# Altium schematic sheet Schematic_PixelRing.SchDoc
size A4
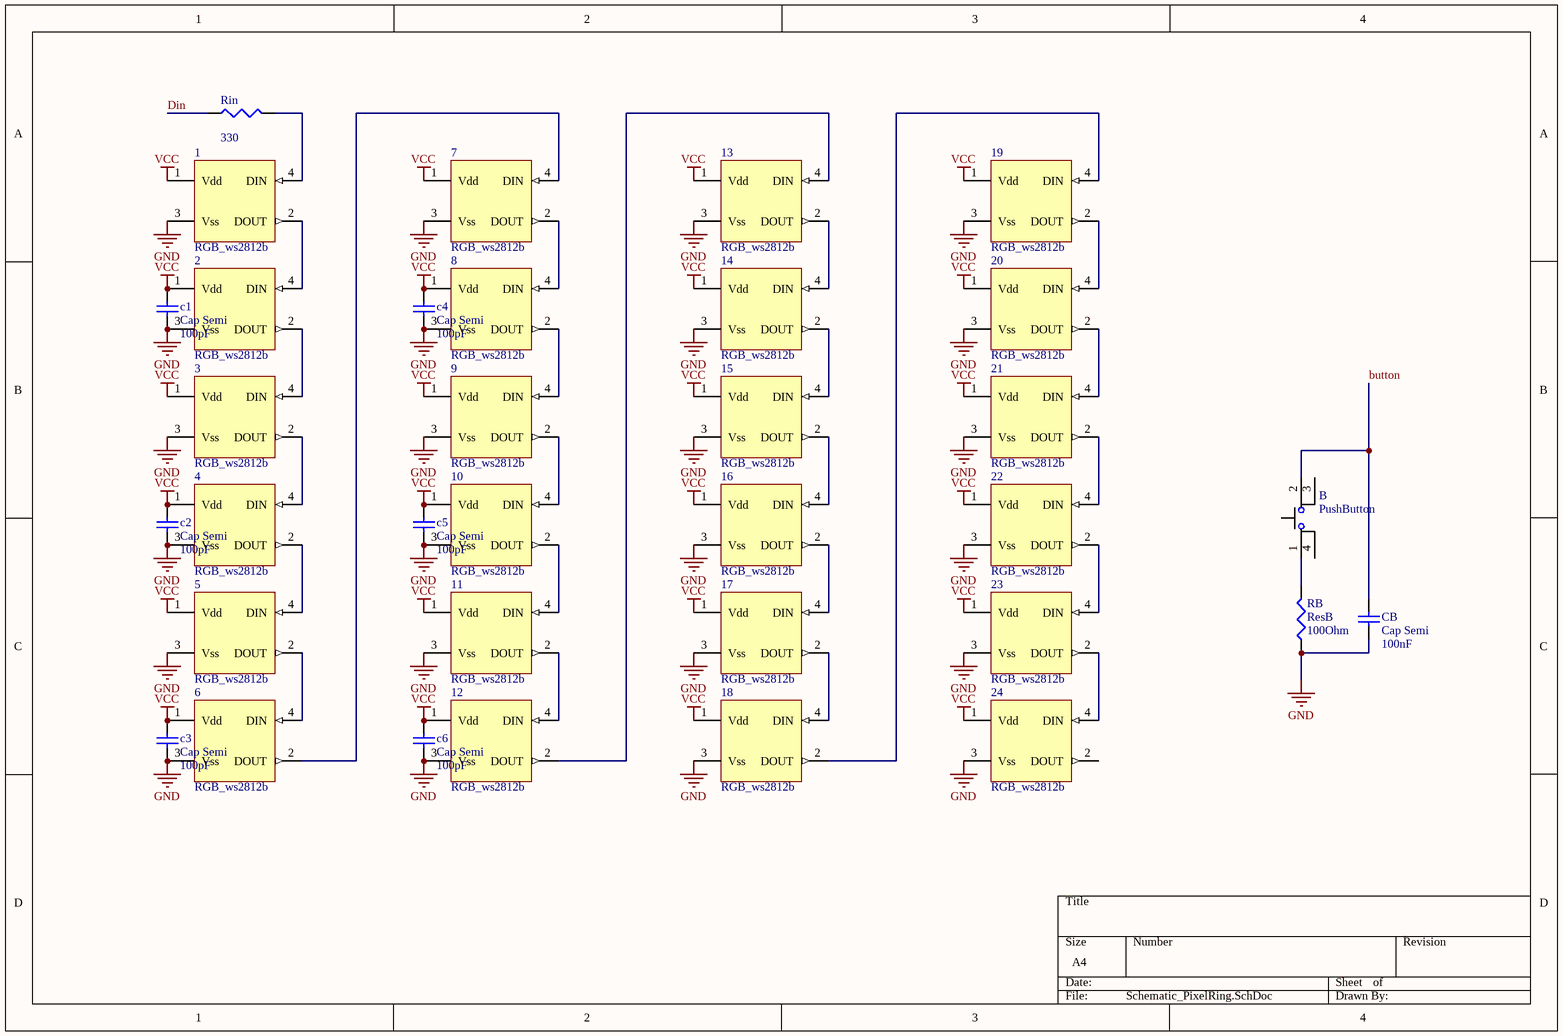
[diagram p0: Schematic_PixelRing.SchDoc]

## Parts
1  RGB_ws2812b  [ws2812b]
2  RGB_ws2812b  [ws2812b]
3  RGB_ws2812b  [ws2812b]
4  RGB_ws2812b  [ws2812b]
5  RGB_ws2812b  [ws2812b]
6  RGB_ws2812b  [ws2812b]
7  RGB_ws2812b  [ws2812b]
8  RGB_ws2812b  [ws2812b]
9  RGB_ws2812b  [ws2812b]
10  RGB_ws2812b  [ws2812b]
11  RGB_ws2812b  [ws2812b]
12  RGB_ws2812b  [ws2812b]
13  RGB_ws2812b  [ws2812b]
14  RGB_ws2812b  [ws2812b]
15  RGB_ws2812b  [ws2812b]
16  RGB_ws2812b  [ws2812b]
17  RGB_ws2812b  [ws2812b]
18  RGB_ws2812b  [ws2812b]
19  RGB_ws2812b  [ws2812b]
20  RGB_ws2812b  [ws2812b]
21  RGB_ws2812b  [ws2812b]
22  RGB_ws2812b  [ws2812b]
23  RGB_ws2812b  [ws2812b]
24  RGB_ws2812b  [ws2812b]
B  PushButton  [SW 6mm]
c1  Cap Semi  value 100pF  [6-0805_N]
c2  Cap Semi  value 100pF  [6-0805_N]
c3  Cap Semi  value 100pF  [6-0805_N]
c4  Cap Semi  value 100pF  [6-0805_N]
c5  Cap Semi  value 100pF  [6-0805_N]
c6  Cap Semi  value 100pF  [6-0805_N]
CB  Cap Semi  value 100nF  [6-0805_N]
RB  ResB  value 100Ohm  [6-0805_N]
Rin  value 330  [6-0805_N]

## Nets
GND: 1.3(Vss) 2.3(Vss) 3.3(Vss) 4.3(Vss) 5.3(Vss) 6.3(Vss) 7.3(Vss) 8.3(Vss) 9.3(Vss) 10.3(Vss) 11.3(Vss) 12.3(Vss) 13.3(Vss) 14.3(Vss) 15.3(Vss) 16.3(Vss) 17.3(Vss) 18.3(Vss) 19.3(Vss) 20.3(Vss) 21.3(Vss) 22.3(Vss) 23.3(Vss) 24.3(Vss) c1.1 c2.1 c3.1 c4.1 c5.1 c6.1 CB.1 RB.1
VCC: 1.1(Vdd) 2.1(Vdd) 3.1(Vdd) 4.1(Vdd) 5.1(Vdd) 6.1(Vdd) 7.1(Vdd) 8.1(Vdd) 9.1(Vdd) 10.1(Vdd) 11.1(Vdd) 12.1(Vdd) 13.1(Vdd) 14.1(Vdd) 15.1(Vdd) 16.1(Vdd) 17.1(Vdd) 18.1(Vdd) 19.1(Vdd) 20.1(Vdd) 21.1(Vdd) 22.1(Vdd) 23.1(Vdd) 24.1(Vdd) c1.2 c2.2 c3.2 c4.2 c5.2 c6.2
button: B.2(Gnd) CB.2
Din: Rin.1
Net1_2: 1.2(DOUT) 2.4(DIN)
Net1_4: 1.4(DIN) Rin.2
Net2_2: 2.2(DOUT) 3.4(DIN)
Net3_2: 3.2(DOUT) 4.4(DIN)
Net4_2: 4.2(DOUT) 5.4(DIN)
Net5_2: 5.2(DOUT) 6.4(DIN)
Net6_2: 6.2(DOUT) 7.4(DIN)
Net7_2: 7.2(DOUT) 8.4(DIN)
Net8_2: 8.2(DOUT) 9.4(DIN)
Net9_2: 9.2(DOUT) 10.4(DIN)
Net10_2: 10.2(DOUT) 11.4(DIN)
Net11_2: 11.2(DOUT) 12.4(DIN)
Net12_2: 12.2(DOUT) 13.4(DIN)
Net13_2: 13.2(DOUT) 14.4(DIN)
Net14_2: 14.2(DOUT) 15.4(DIN)
Net15_2: 15.2(DOUT) 16.4(DIN)
Net16_2: 16.2(DOUT) 17.4(DIN)
Net17_2: 17.2(DOUT) 18.4(DIN)
Net18_2: 18.2(DOUT) 19.4(DIN)
Net19_2: 19.2(DOUT) 20.4(DIN)
Net20_2: 20.2(DOUT) 21.4(DIN)
Net21_2: 21.2(DOUT) 22.4(DIN)
Net22_2: 22.2(DOUT) 23.4(DIN)
Net23_2: 23.2(DOUT) 24.4(DIN)
NetB_1: B.1(Gnd) RB.2

Not connected (* = marked no-connect by the designer): 24 2(DOUT); B 3(Gnd) 4(Gnd)

## Library data of the parts
c1-c6 CB = Cap Semi: Capacitor (Semiconductor SIM Model); Published: 8-Jun-2000; LatestRevisionDate: 29-May-2009; LatestRevisionNote: IPC-7351 Footprint Added.; PackageReference: C1206; Publisher: Altium Limited; PackageDescription: Chip Capacitor
RB Rin = Res3: Resistor; Published: 8-Jun-2000; LatestRevisionDate: 29-May-2009; LatestRevisionNote: IPC-7351 Footprint Added.; PackageReference: J1-0603; Publisher: Altium Limited; PackageDescription: Chip Resistor